# EAGLE design motor (EAGLE 6.5.0)
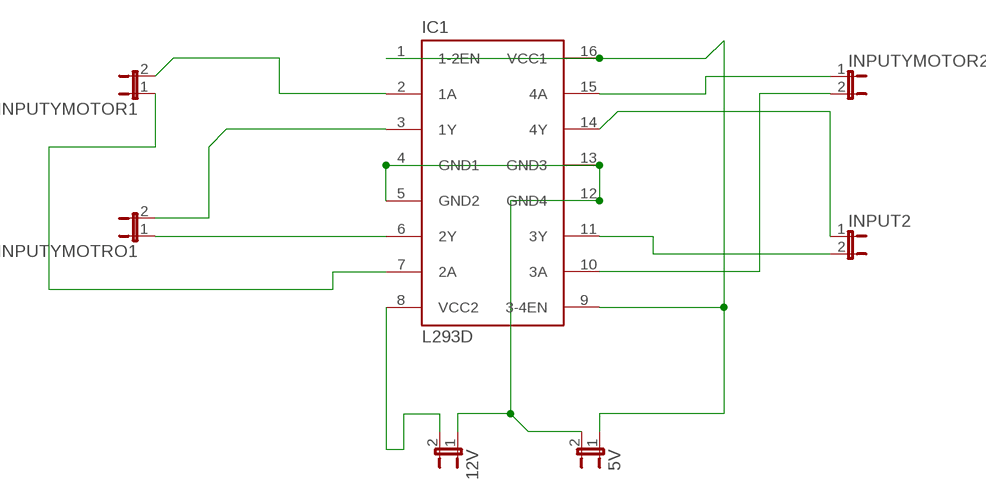
[diagram p0: schematic, sheet 1]

## Parts
5V  JP1E  [JP1]
12V  JP1E  [JP1]
IC1  L293D  [DIL16]
INPUT2  JP1E  [JP1]
INPUTYMOTOR1  JP1E  [JP1]
INPUTYMOTOR2  JP1E  [JP1]
INPUTYMOTRO1  JP1E  [JP1]

## Nets
N$1: IC1.2(1A) INPUTYMOTOR1.2
N$2: IC1.7(2A) INPUTYMOTOR1.1
N$3: IC1.3(1Y) INPUTYMOTRO1.2
N$4: IC1.6(2Y) INPUTYMOTRO1.1
N$5: 5V.2 12V.1 IC1.4(GND1) IC1.5(GND2) IC1.12(GND4) IC1.13(GND3)
N$6: 12V.2 IC1.8(VCC2)
N$7: 5V.1 IC1.1(1-2EN) IC1.9(3-4EN) IC1.16(VCC1)
N$8: IC1.15(4A) INPUTYMOTOR2.1
N$9: IC1.10(3A) INPUTYMOTOR2.2
N$10: IC1.11(3Y) INPUT2.2
N$11: IC1.14(4Y) INPUT2.1

## Library data of the parts
5V 12V INPUT2 INPUTYMOTOR1 INPUTYMOTOR2 INPUTYMOTRO1 = jumper:JP1E: JUMPER
IC1 = st-microelectronics:L293D: PUSH-PULL 4 CHANNEL DRIVER; MPN: L293D; OC_FARNELL: 9589619; OC_NEWARK: 56P8249

## Board
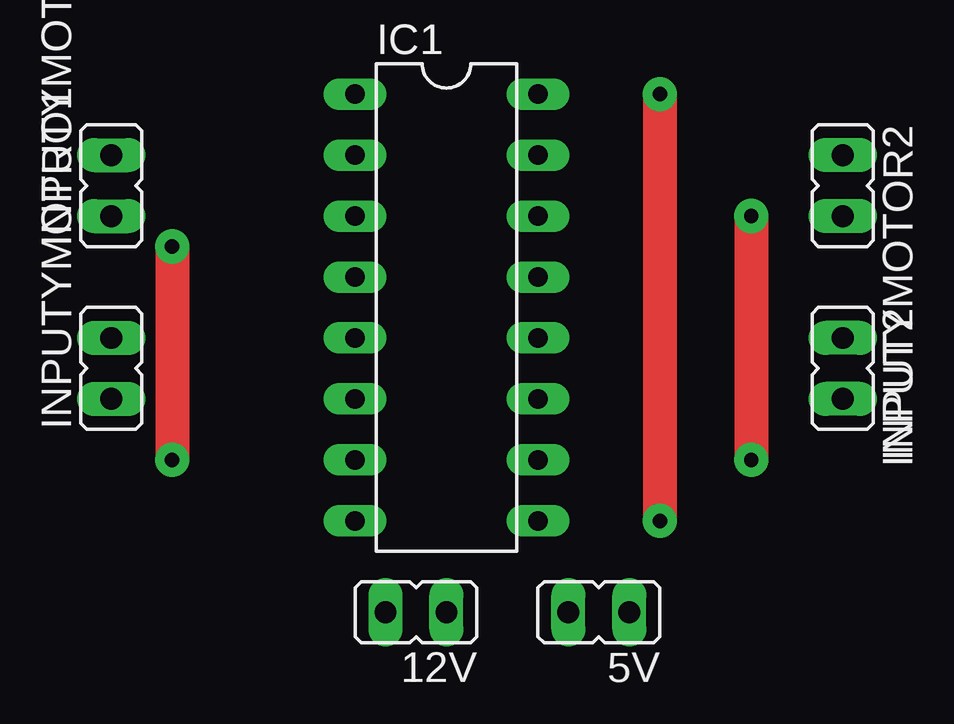
[diagram p1: board, top side]
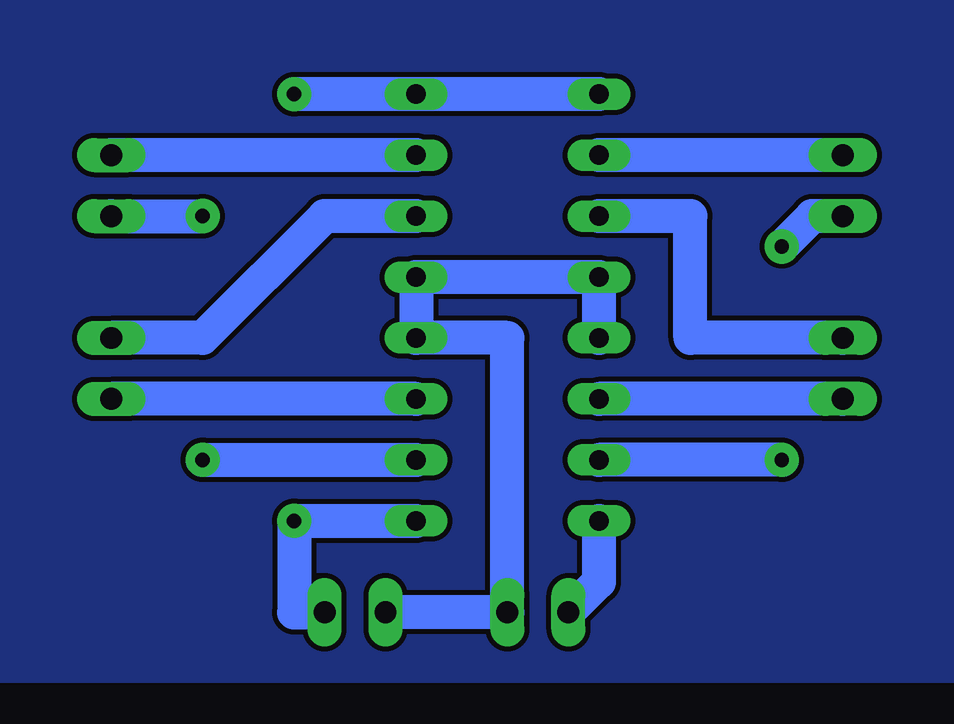
[diagram p2: board, bottom side, seen from below]

No outline drawn. Coordinates in mm, seen from the top.
Copper layers (1*16): Top 0.035mm / dielectric 1.5mm / Bottom 0.035mm
Design rules "default": minimum track width 10mil, minimum drill 24mil, track to track 8mil, track to pad 8mil, pad to pad 8mil, via to via 8mil, smd to smd 8mil, copper to edge 40mil, drill to drill 8mil, minimum pad ring 10mil, minimum via ring 8mil, stop-mask expansion 4mil, vias tented up to drill 0mil, thermal gap 10mil

### Footprints (pad centres in the part's own frame; a part is rotated, then mirrored left to right if it is on the bottom)
JP1 = drill 0.914 long: 1 0,-1.27; 2 0,1.27
DIL16 = drill 0.813 long: 1 -8.89,-3.81; 2 -6.35,-3.81; 3 -3.81,-3.81; 4 -1.27,-3.81; 5 1.27,-3.81; 6 3.81,-3.81; 7 6.35,-3.81; 8 8.89,-3.81; 9 8.89,3.81; 10 6.35,3.81; 11 3.81,3.81; 12 1.27,3.81; 13 -1.27,3.81; 14 -3.81,3.81; 15 -6.35,3.81; 16 -8.89,3.81

### Placement (x,y rotation side)
5V  77.47,25.4 90 top
12V  69.85,25.4 90 top
IC1  71.12,38.1 270 top
INPUT2  87.63,35.56 180 top
INPUTYMOTOR1  57.15,43.18 0 top
INPUTYMOTOR2  87.63,43.18 180 top
INPUTYMOTRO1  57.15,35.56 0 top

### Tracks (layer width: path | path; a pad name or v marks a point on that pad's centre or on a via)
N$1
  Bottom 1.422: INPUTYMOTOR1.2 IC1.2
N$2  (via drill 0.6 pad 1.42)
  Top 1.422: v59.69,40.64 v59.69,31.75
  Bottom 1.422: INPUTYMOTOR1.1 58.42,41.91 v59.69,40.64 | v59.69,31.75 IC1.7
N$3
  Bottom 1.422: INPUTYMOTRO1.2 63.5,36.83 63.5,41.91 IC1.3
N$4
  Bottom 1.422: INPUTYMOTRO1.1 IC1.6
N$5
  Bottom 1.422: IC1.5 IC1.4 IC1.13 IC1.12 71.12,36.83 12V.1 5V.2
N$6
  Bottom 1.422: IC1.8 67.31,26.67 12V.2
N$7  (via drill 0.6 pad 1.42)
  Top 1.422: v80.01,46.99 v80.01,29.21
  Bottom 1.422: IC1.1 IC1.16 v80.01,46.99 | IC1.9 v80.01,29.21 80.01,25.4 5V.1
N$8
  Bottom 1.422: IC1.15 INPUTYMOTOR2.1
N$9  (via drill 0.6 pad 1.42)
  Top 1.422: v83.82,41.91 v83.82,31.75
  Bottom 1.422: INPUTYMOTOR2.2 v83.82,41.91 | v83.82,31.75 IC1.10
N$10
  Bottom 1.422: IC1.11 INPUT2.2
N$11
  Bottom 1.422: IC1.14 78.74,41.91 83.82,36.83 INPUT2.1
N$12
  pour Bottom: 52.07,50.8 92.71,50.8 92.71,22.86 52.07,22.86